# Altium schematic sheet Block_Diagram.SchDoc
size 292 x 193 mm; Scale: 1:1; Author: Vishal Y. Bajaj; Organization: ORGANIZATION; Address1: ADDRESS 1; Address2: ADDRESS 2; Address3: ADDRESS 3; Address4: ADDRESS 4; Revision: -; SheetNumber: 1; SheetTotal: 11; ENG_APP_DATE: --/--/--; DSN_APP_DATE: --/--/--; CHK_APP_DATE: --/--/--; Template: A4
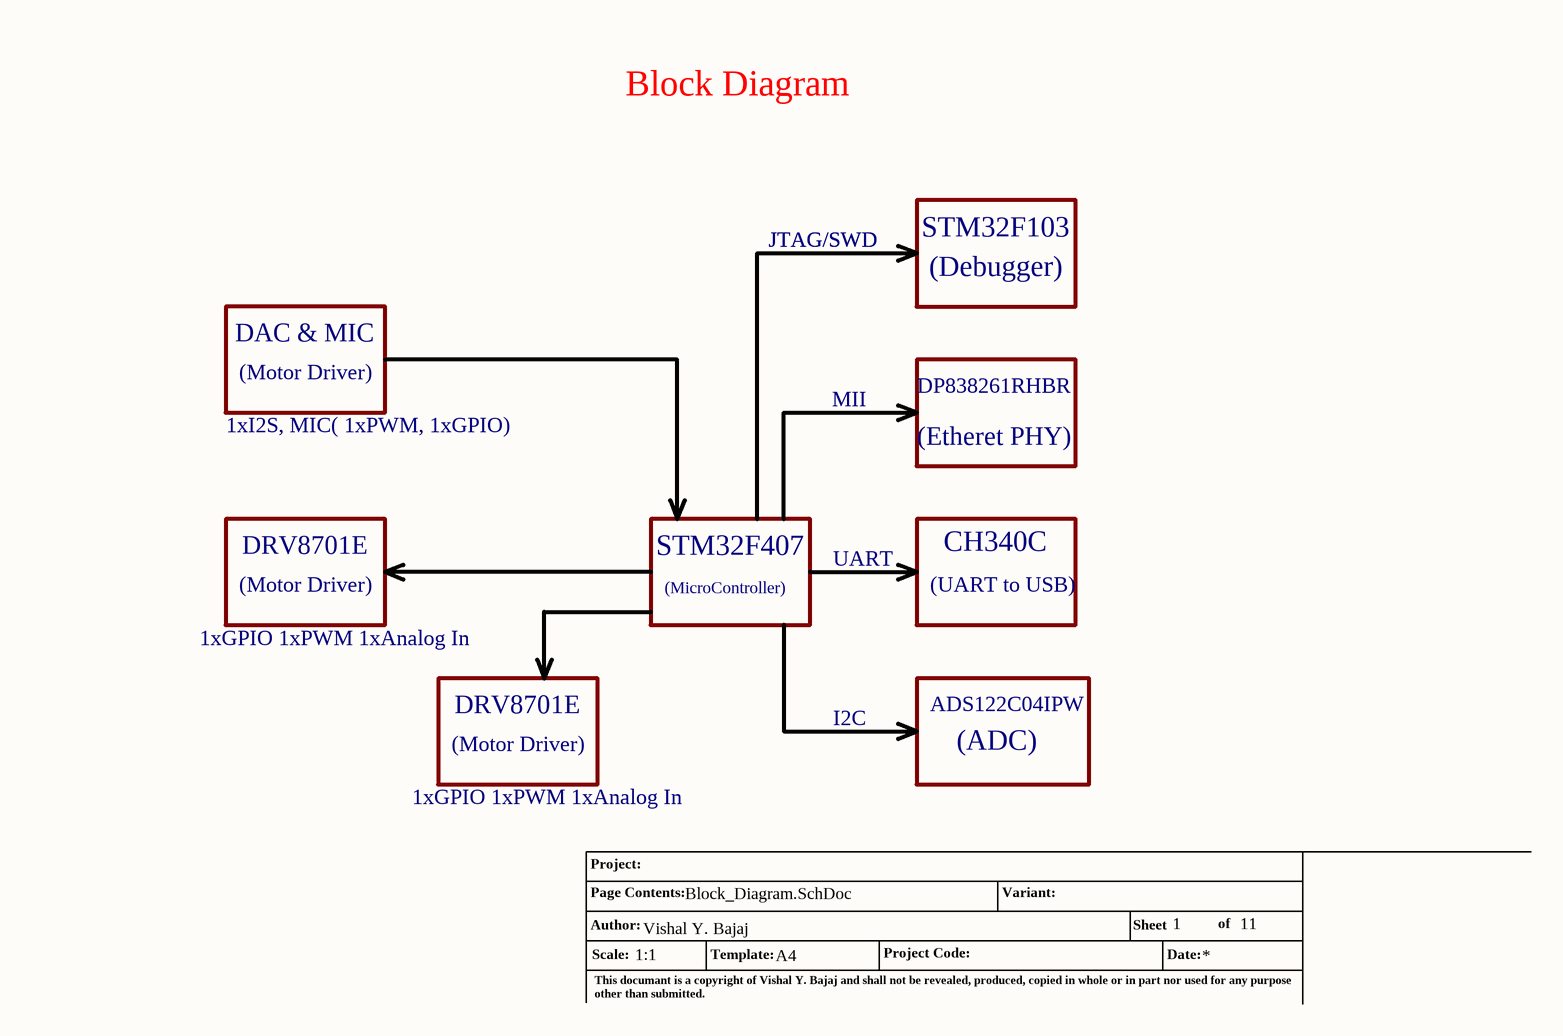
[diagram p0: Block_Diagram.SchDoc]

## Notes on the sheet
- Block Diagram
- JTAG/SWD
- STM32F103
- (Debugger)
- (Motor Driver)
- DAC & MIC
- 1xI2S, MIC( 1xPWM, 1xGPIO)
- MII
- DP838261RHBR
- (Etheret PHY)
- DRV8701E
- STM32F407
- UART
- CH340C
- 1xGPIO 1xPWM 1xAnalog In
- (MicroController)
- (UART to USB)
- I2C
- ADS122C04IPW
- (ADC)
- Project:
- Page Contents:
- Variant:
- Author:
- Scale:
- Template:
- Project Code:
- Sheet
- Date:
- of
- This documant is a copyright of Vishal Y. Bajaj and shall not be revealed, produced, copied in whole or in part nor used for any purpose
  other than submitted.
- DWG. NO.
- REV.
- SHT.
- THIS DOCUMENT AND THE DATA DISCLOSED HEREIN OR HEREWITH IS THE PROPERTY OF ALTIUM LIMITED AND MAY BE FREELY DISTRIBUTED IN WHOLE. NO RIGHTS ARE RESERVED OR EXPRESS OR IMPLIED WARANTEE GIVEN.
- REVISION
- DESCRIPTION
- DATE
- APPROVED
- ENG:
- APPROVALS
- PROJECT
- DSN:
- CHK:
- REFERENCE DOCUMENTS
- PROJECT REVISION:
- TITLE
- DOCUMENT REVISION:
- DESIGN ITEM:
- BOM:
- FAB DWG:
- PCB DWG:
- ASSY DWG:
- SCALE:
- SIZE
- B
- CAGE CODE
- FILE NAME
- DWG NO.
- SHEET
- OF
- REV